# Altium project TAUV-Powerboard.PrjPCB
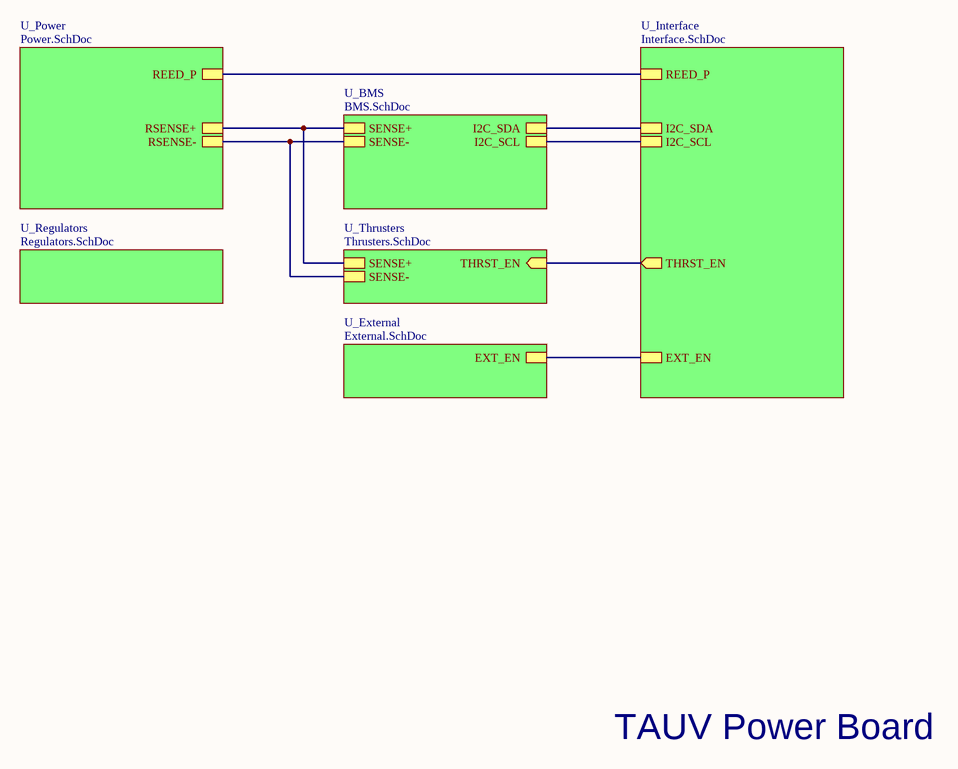
[diagram p0: Main.SchDoc]
7 sheets, 159 parts. Net scope: hierarchical (ports join the sheet entries above them; power ports are global).
Board file: TAUV-Powerboard.PcbDoc
Sheets:
  Main.SchDoc
    U_BMS = BMS.SchDoc
    U_Interface = Interface.SchDoc
    U_Power = Power.SchDoc
    U_Regulators = Regulators.SchDoc
    U_Thrusters = Thrusters.SchDoc
    U_External = External.SchDoc

## Sheet Main.SchDoc
size A

### Sub-sheets
U_BMS = BMS.SchDoc: SENSE-, I2C_SDA, I2C_SCL, SENSE+
U_External = External.SchDoc: EXT_EN
U_Interface = Interface.SchDoc: I2C_SDA, I2C_SCL, THRST_EN (out), REED_P, EXT_EN
U_Power = Power.SchDoc: RSENSE-, RSENSE+, REED_P
U_Regulators = Regulators.SchDoc: no entries
U_Thrusters = Thrusters.SchDoc: SENSE-, THRST_EN (in), SENSE+

### Nets
RSENSE-: sheet U_BMS/SENSE-, sheet U_Power/RSENSE-, sheet U_Thrusters/SENSE-
RSENSE+: sheet U_BMS/SENSE+, sheet U_Power/RSENSE+, sheet U_Thrusters/SENSE+
THRST_EN: sheet U_Interface/THRST_EN, sheet U_Thrusters/THRST_EN
NetP3_5: sheet U_Interface/REED_P, sheet U_Power/REED_P
NetP3_6: sheet U_BMS/I2C_SCL, sheet U_Interface/I2C_SCL
NetP3_11: sheet U_Interface/EXT_EN, sheet U_External/EXT_EN
NetP3_13: sheet U_BMS/I2C_SDA, sheet U_Interface/I2C_SDA

### Notes on the sheet
- TAUV Power Board

## Sheet BMS.SchDoc
size A4
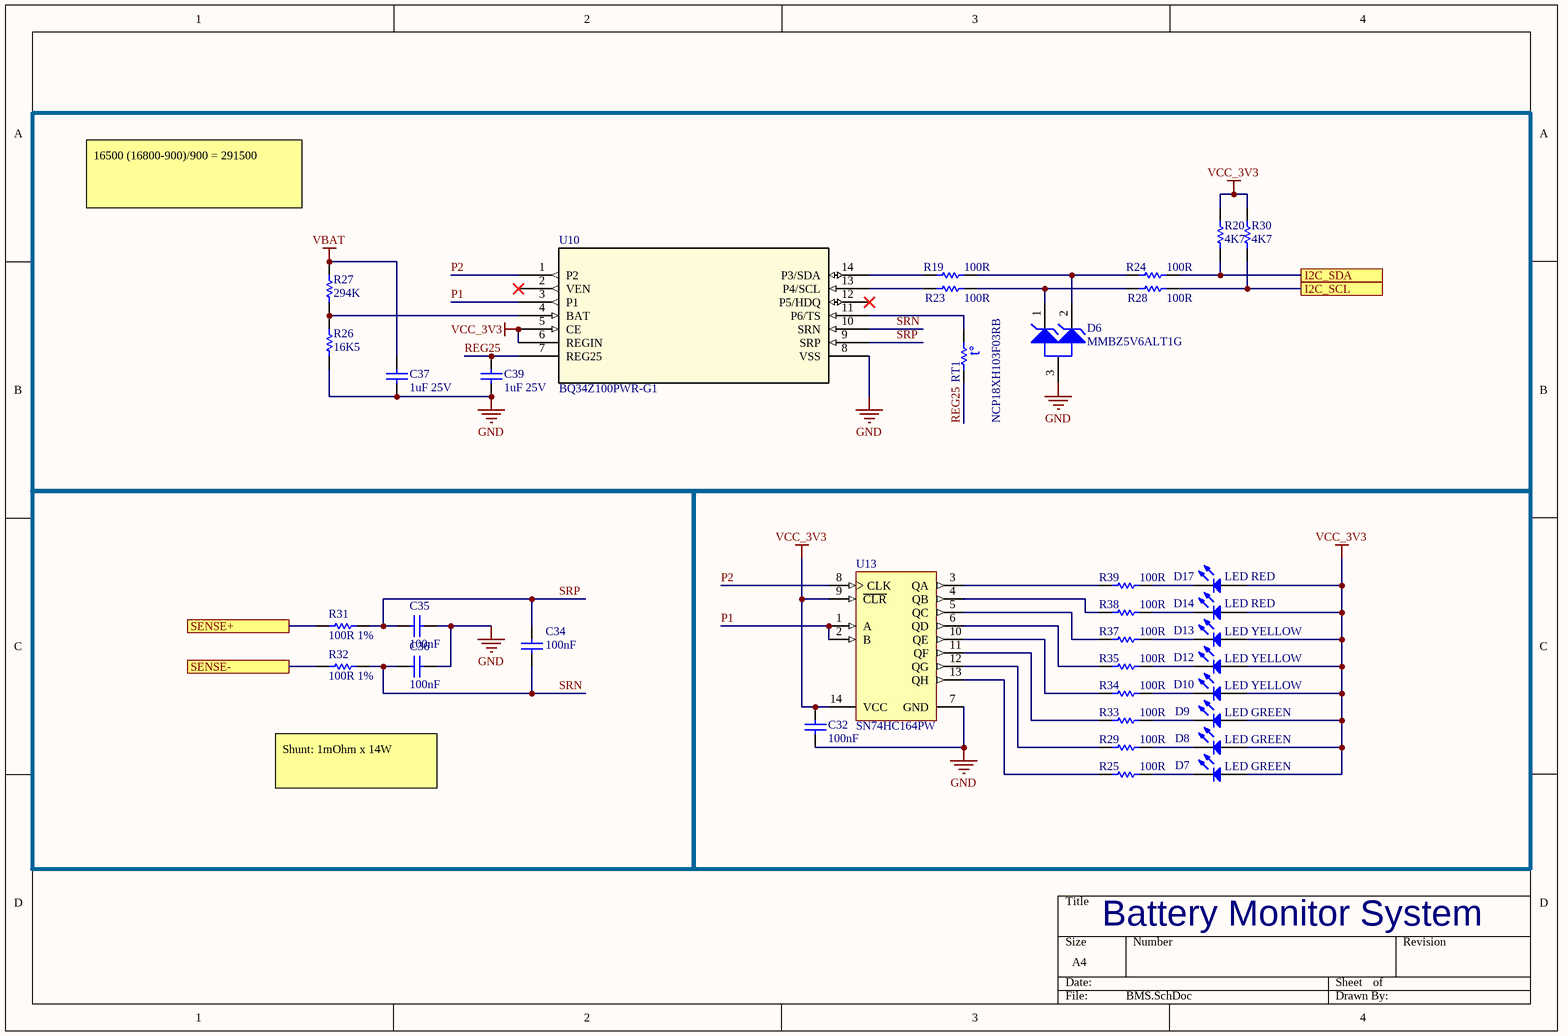
[diagram p1: BMS.SchDoc]

### Parts
C32  100nF  [CAPC0603(1608)100_L]
C34  100nF  [CAPC0603(1608)100_L]
C35  100nF  [CAPC0603(1608)100_L]
C36  100nF  [CAPC0603(1608)100_L]
C37  1uF 25V  [CAPC0603(1608)100_L]
C39  1uF 25V  [CAPC0603(1608)100_L]
D6  MMBZ5V6ALT1G  [ONSC-SOT-23-3-318-08_V]
D7  LED GREEN  [LED_0805]
D8  LED GREEN  [LED_0805]
D9  LED GREEN  [LED_0805]
D10  LED YELLOW  [LED_0805]
D12  LED YELLOW  [LED_0805]
D13  LED YELLOW  [LED_0805]
D14  LED RED  [LED_0805]
D17  LED RED  [LED_0805]
R19  100R  [RESC0603(1608)_L]
R20  4K7  [RESC0603(1608)_L]
R23  100R  [RESC0603(1608)_L]
R24  100R  [RESC0603(1608)_L]
R25  100R  [RESC0603(1608)_L]
R26  16K5  [RESC0603(1608)_L]
R27  294K  [RESC0603(1608)_L]
R28  100R  [RESC0603(1608)_L]
R29  100R  [RESC0603(1608)_L]
R30  4K7  [RESC0603(1608)_L]
R31  100R 1%  [RESC0603(1608)_L]
R32  100R 1%  [RESC0603(1608)_L]
R33  100R  [RESC0603(1608)_L]
R34  100R  [RESC0603(1608)_L]
R35  100R  [RESC0603(1608)_L]
R37  100R  [RESC0603(1608)_L]
R38  100R  [RESC0603(1608)_L]
R39  100R  [RESC0603(1608)_L]
RT1  NCP18XH103F03RB  [MURA-NCP18XH103F03RB-2_V]
U10  BQ34Z100PWR-G1  [PW14]
U13  SN74HC164PW  [PW0014A_N]

### Ports
I2C_SCL, I2C_SDA, SENSE+, SENSE-

### Nets
GND: C32.1 C35.1 C36.1 C37.1 C39.1 D6.3(A) R26.1 U10.8(VSS) U13.7(GND)
RSENSE-: R32.1 ; port SENSE-
VBAT: C37.2 R27.2
VCC_3V3: C32.2 D7.2(A) D8.2(A) D9.2(A) D10.2(A) D12.2(A) D13.2(A) D14.2(A) D17.2(A) R20.2 R30.2 U10.5(CE) U10.6(REGIN) U13.9(~{CLR}) U13.14(VCC)
P1: U10.3(P1) U13.1(A) U13.2(B)
P2: U10.1(P2) U13.8(CLK)
REG25: C39.2 RT1.1 U10.7(REG25)
RSENSE+: R31.1 ; port SENSE+
SRN: C34.1 C36.2 R32.2 U10.10(SRN)
SRP: C34.2 C35.2 R31.2 U10.9(SRP)
NetD6_1: D6.1(K1) R23.2 R28.1
NetD6_2: D6.2(K2) R19.2 R24.1
NetD7_1: D7.1(K) R25.2
NetD8_1: D8.1(K) R29.2
NetD9_1: D9.1(K) R33.2
NetD10_1: D10.1(K) R34.2
NetD12_1: D12.1(K) R35.2
NetD13_1: D13.1(K) R37.2
NetD14_1: D14.1(K) R38.2
NetD17_1: D17.1(K) R39.2
NetP3_6: R28.2 R30.1 ; port I2C_SCL
NetP3_13: R20.1 R24.2 ; port I2C_SDA
NetR19_1: R19.1 U10.14(P3/SDA)
NetR23_1: R23.1 U10.13(P4/SCL)
NetR25_1: R25.1 U13.13(QH)
NetR26_2: R26.2 R27.1 U10.4(BAT)
NetR29_1: R29.1 U13.12(QG)
NetR33_1: R33.1 U13.11(QF)
NetR34_1: R34.1 U13.10(QE)
NetR35_1: R35.1 U13.6(QD)
NetR37_1: R37.1 U13.5(QC)
NetR38_1: R38.1 U13.4(QB)
NetR39_1: R39.1 U13.3(QA)
NetRT1_2: RT1.2 U10.11(P6/TS)

Not connected (* = marked no-connect by the designer): U10 2(VEN)* 12(P5/HDQ)*

### Notes on the sheet
- 16500 (16800-900)/900 = 291500
- Shunt: 1mOhm x 14W
- Battery Monitor System
- (in symbol CMP-2000-05271-1) t°

### Library data of the parts
C32 C34-C36 = CMP-1035-02595-1: CAP 100nF 100V ±10% 0603 (1608 Metric) Thickness 1mm SMD; Tolerance: Â±10%; Case-EIA: 0603; Case-Metric: 1608; Rated Voltage: 100 V; Value: 100nF; Technology: SMT; Max Thickness: 1 mm
C37 C39 = CMP-1035-02740-1: CAP 1uF 25V ±10% 0603 (1608 Metric) Thickness 1mm SMD; Tolerance: Â±10%; Case-Metric: 1608; Case-EIA: 0603; Technology: SMT; Rated Voltage: 25 V; Max Thickness: 1 mm; Value: 1uF
D6 = CMP-1060-01222-1: 24 W Peak Power Zener Transient Voltage Suppressor, Dual Common Anode Zeners for ESD Protection, 3-Pin SOT-23, Pb-Free, Tape and Reel; Manufacturer: On Semiconductor; VZ Typ (V): 5.6; PackageVersion: Rev. AP, 11/2009; ComponentLink1URL: http://www.onsemi.com/; Packing: Tape and Reel; DatasheetVersion: Rev. 13; ComponentLink1Description: Manufacturer URL; ComponentLink3URL: http://www.onsemi.cn/pub_link/Collateral/318-08.PDF; ComponentLink2Description: Datasheet; PackageDescription: 3-Pin Small Outline Transistor, Body 2.92 x 1.3 mm, Pitch 0.95 mm; ComponentLink3Description: Package Specification; RoHS: Pb-Free; ComponentLink2URL: http://www.onsemi.cn/pub_link/Collateral/MMBZ5V6ALT1-D.PDF; PackageReference: SOT-23-3-318-08; Mounting Technology: Surface Mount; PartNumber: MMBZ5V6ALT1G
D7-D9 = LED0: led / LTST-C171KRKT; Manufacturer: Lite-On Inc.; Manufacturer Part Number: LTST-C171KGKT; Lens Color: Colorless; Lens Transparency: Clear; Millicandela Rating: 35mcd; Lens Style/Size: Rectangle with Flat Top, 1.40mm x 1.25mm; Voltage - Forward (Vf) (Typ): 2V; Current - Test: 20mA; Viewing Angle: 130°; Wavelength - Dominant: 571nm; Wavelength - Peak: 574nm; Supplier 1: Digi-Key; Supplier Part Number 1: 160-1426-1-ND; RoHS: RoHS Compliant; Category: Optoelectronics; Stock 1: 350441; Pricing 1: 1=0.31, 10=0.225, 25=0.1656, 100=0.1183, 250=0.0804, 500=0.07096, 1000=0.05558 (USD); Packaging: Cut Tape (CT); Part Status: Active; Color: Green; Mounting Type: Surface Mount; Features: -; Package / Case: 0805 (2012 Metric); Size / Dimension: 2.00mm L x 1.25mm W; Height (Max): 0.90mm; ComponentLink1URL: http://optoelectronics.liteon.com/upload/download/DS22-2000-118/LTST-C171KGKT.pdf; ComponentLink1Description: http://optoelectronics.liteon.com/upload/download/DS22-2000-118/LTST-C171KGKT.pdf
D10 D12 D13 = LED0: led / LTST-C171KSKT; Manufacturer: Lite-On Inc.; Color: Green; Lens Color: Colorless; Lens Transparency: Clear; Millicandela Rating: 35mcd; Lens Style/Size: Rectangle with Flat Top, 1.40mm x 1.25mm; Voltage - Forward (Vf) (Typ): 2V; Current - Test: 20mA; Viewing Angle: 130°; Wavelength - Dominant: 571nm; Wavelength - Peak: 574nm; Supplier 1: Digi-Key; Supplier Part Number 1: 160-1428-1-ND; Manufacturer Part Number: LTST-C171KSKT; RoHS: RoHS Compliant; Category: Optoelectronics; Stock 1: 350441; Pricing 1: 1=0.31, 10=0.225, 25=0.1656, 100=0.1183, 250=0.0804, 500=0.07096, 1000=0.05558 (USD); Packaging: Cut Tape (CT); Part Status: Active; Mounting Type: Surface Mount; Features: -; Package / Case: 0805 (2012 Metric); Size / Dimension: 2.00mm L x 1.25mm W; Height (Max): 0.90mm; ComponentLink1URL: http://optoelectronics.liteon.com/upload/download/DS22-2000-110/LTST-C171KSKT.pdf; ComponentLink1Description: http://optoelectronics.liteon.com/upload/download/DS22-2000-110/LTST-C171KSKT.pdf
D14 D17 = LED0: led / LTST-C171KRKT; Manufacturer: Lite-On Inc.; Lens Color: Colorless; Lens Transparency: Clear; Millicandela Rating: 54mcd; Lens Style/Size: Rectangle with Flat Top, 1.40mm x 1.25mm; Voltage - Forward (Vf) (Typ): 2V; Current - Test: 20mA; Viewing Angle: 130°; Wavelength - Dominant: 631nm; Wavelength - Peak: 639nm; Supplier 1: Digi-Key; Supplier Part Number 1: 160-1427-1-ND; Manufacturer Part Number: LTST-C171KRKT; RoHS: RoHS Compliant; Category: Optoelectronics; Stock 1: 260544; Pricing 1: 1=0.31, 10=0.225, 25=0.1656, 100=0.1183, 250=0.0804, 500=0.07096, 1000=0.05558 (USD); Packaging: Cut Tape (CT); Part Status: Active; Color: Red; Mounting Type: Surface Mount; Features: -; Package / Case: 0805 (2012 Metric); Size / Dimension: 2.00mm L x 1.25mm W; Height (Max): 0.80mm; ComponentLink1URL: http://optoelectronics.liteon.com/upload/download/DS22-2000-109/LTST-C171KRKT.pdf; ComponentLink1Description: http://optoelectronics.liteon.com/upload/download/DS22-2000-109/LTST-C171KRKT.pdf
R19 R23 R24 R28 R31 R32 = CMP-1012-00397-1: 100R 0.1W 1% 0603 (1608 Metric)  SMD; Value: 100.00 Ohm; Case-EIA: 0603; Case-Metric: 1608; Technology: SMT; Tolerance: 1 %; Power: 0.1 W
R20 R30 = CMP-1012-00586-1: 4K7 0.1W 1% 0603 (1608 Metric)  SMD; Case-EIA: 0603; Case-Metric: 1608; Value: 4700.00 Ohm; Power: 0.1 W; Tolerance: 1 %; Technology: SMT
R25 R29 R33-R35 R37-R39 = CMP-1012-00050-1: 100R 0.1W 5% 0603 (1608 Metric)  SMD; Case-EIA: 0603; Value: 100.00 Ohm; Case-Metric: 1608; Tolerance: 5 %; Technology: SMT; Power: 0.1 W
R26 = CMP-1012-00646-1: 16K5 0.1W 1% 0603 (1608 Metric)  SMD; Case-Metric: 1608; Value: 16500.00 Ohm; Case-EIA: 0603; Technology: SMT; Power: 0.1 W; Tolerance: 1 %
R27 = CMP-1012-00787-1: 294K 0.1W 1% 0603 (1608 Metric)  SMD; Case-Metric: 1608; Value: 294000.00 Ohm; Case-EIA: 0603; Power: 0.1 W; Tolerance: 1 %; Technology: SMT
RT1 = CMP-2000-05271-1: NTC Thermistor, 10 KOhm, +/- 1%, 0.1 W, -40 to 125 degC, 0603 (1608 Metric), RoHS, Tape and Reel; Manufacturer: Murata; B-constant: 3434K; Resistance: 10kO; Rated Current: 310A; Datasheet URL: http://www.jameco.com/Jameco/Products/ProdDS/1870999.pdf; Datasheet Version: Apr-05; Temperature Range: -40to+125degC; Tolerance (%): ±1%; Manufacturer URL: http://www.murata.com/; Type: NTC
U10 = BQ34Z100PWR-G1: No Description Available; Vendor: Texas Instruments; Built_By: EMA_UL_Team; Manufacturer_Part_Number: BQ34Z100PWR-G1; Copyright: Copyright (C) 2018 Accelerated Designs. All rights reserved; RefDes: RefDes; Type: DEV; Value: Value
U13 = CMP-0780-00173-3: 8-Bit Parallel-Out Serial Shift Registers, PW0014A, TUBE; Manufacturer: Texas Instruments; Output Drive (IOL/IOH)(Max)(mA): 5.2/-5.2; Technology Family: HC; 3-State Output: No; Voltage(Nom)(V): 6; ICC @ Nom Voltage(Max)(mA): 0.08; Rating: Catalog; F @ Nom Voltage(Max)(Mhz): 28; Output Type: CMOS; tpd @ Nom Voltage(Max)(ns): 38; VCC(Min)(V): 2; Bits: 4; DatasheetVersion: SCLS115F; VCC(Max)(V): 6; PackageReference: PW0014A; Input Type: CMOS; PackageVersion: http://www.ti.com/lit/ml/mpds360/mpds360.pdf; Operating Temperature Range(C): -40 to 125; Code_JEDEC: MO-153; Generic Part Number: SN74HC164

## Sheet Interface.SchDoc
size A
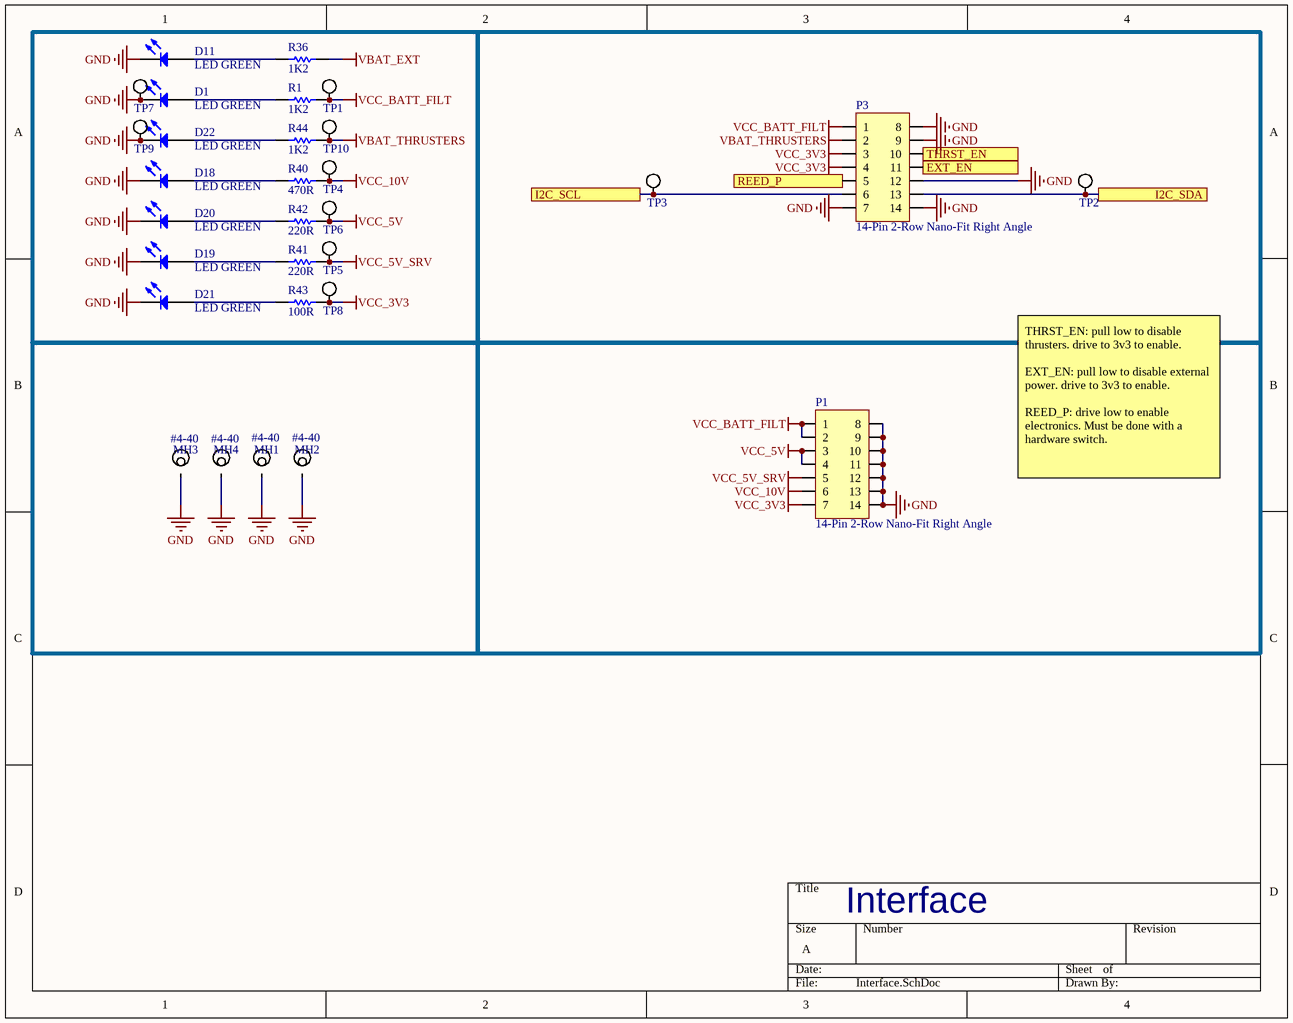
[diagram p2: Interface.SchDoc]

### Parts
D1  LED GREEN  [LED_0805]
D11  LED GREEN  [LED_0805]
D18  LED GREEN  [LED_0805]
D19  LED GREEN  [LED_0805]
D20  LED GREEN  [LED_0805]
D21  LED GREEN  [LED_0805]
D22  LED GREEN  [LED_0805]
MH1  #4-40  [Mounting Hole #4-40]
MH2  #4-40  [Mounting Hole #4-40]
MH3  #4-40  [Mounting Hole #4-40]
MH4  #4-40  [Mounting Hole #4-40]
P1  14-Pin 2-Row Nano-Fit Right Angle  [MOLEX NANO-FIT 2X7 - Right Angle]
P3  14-Pin 2-Row Nano-Fit Right Angle  [MOLEX NANO-FIT 2X7 - Right Angle]
R1  1K2  [RESC0603(1608)_L]
R36  1K2  [RESC0603(1608)_L]
R40  470R  [RESC0603(1608)_L]
R41  220R  [RESC0603(1608)_L]
R42  220R  [RESC0603(1608)_L]
R43  100R  [RESC0603(1608)_L]
R44  1K2  [RESC0603(1608)_L]
TP1  Test Point Loop  [Test Point Loop - Black]  (value not drawn)
TP2  Test Point Loop  [Test Point Loop - Black]  (value not drawn)
TP3  Test Point Loop  [Test Point Loop - Black]  (value not drawn)
TP4  Test Point Loop  [Test Point Loop - Black]  (value not drawn)
TP5  Test Point Loop  [Test Point Loop - Black]  (value not drawn)
TP6  Test Point Loop  [Test Point Loop - Black]  (value not drawn)
TP7  Test Point Loop  [Test Point Loop - Black]  (value not drawn)
TP8  Test Point Loop  [Test Point Loop - Black]  (value not drawn)
TP9  Test Point Loop  [Test Point Loop - Black]  (value not drawn)
TP10  Test Point Loop  [Test Point Loop - Black]  (value not drawn)

### Ports
EXT_EN (out), I2C_SCL, I2C_SDA, REED_P, THRST_EN (out)

### Nets
GND: D1.1(K) D11.1(K) D18.1(K) D19.1(K) D20.1(K) D21.1(K) D22.1(K) MH1.0 MH2.0 MH3.0 MH4.0 P1.8 P1.9 P1.10 P1.11 P1.12 P1.13 P1.14 P3.7 P3.8 P3.9 P3.12 P3.14 TP7.1 TP9.1
VBAT_EXT: R36.2
VBAT_THRUSTERS: P3.2 R44.2 TP10.1
VCC_3V3: P1.7 P3.3 P3.4 R43.2 TP8.1
VCC_5V: P1.3 P1.4 R42.2 TP6.1
VCC_5V_SRV: P1.5 R41.2 TP5.1
VCC_10V: P1.6 R40.2 TP4.1
VCC_BATT_FILT: P1.1 P1.2 P3.1 R1.2 TP1.1
THRST_EN: P3.10 ; port THRST_EN
NetD1_2: D1.2(A) R1.1
NetD11_2: D11.2(A) R36.1
NetD18_2: D18.2(A) R40.1
NetD19_2: D19.2(A) R41.1
NetD20_2: D20.2(A) R42.1
NetD21_2: D21.2(A) R43.1
NetD22_2: D22.2(A) R44.1
NetP3_5: P3.5 ; port REED_P
NetP3_6: P3.6 TP3.1 ; port I2C_SCL
NetP3_11: P3.11 ; port EXT_EN
NetP3_13: P3.13 TP2.1 ; port I2C_SDA

### Notes on the sheet
- THRST_EN: pull low to disable thrusters. drive to 3v3 to enable.
  EXT_EN: pull low to disable external power. drive to 3v3 to enable.
  REED_P: drive low to enable electronics. Must be done with a hardware switch.
- Interface

### Library data of the parts
D1 D11 D18-D22 = LED0: led; Manufacturer: Lite-On Inc.; Manufacturer Part Number: LTST-C171KGKT; Lens Color: Colorless; Lens Transparency: Clear; Millicandela Rating: 35mcd; Lens Style/Size: Rectangle with Flat Top, 1.40mm x 1.25mm; Voltage - Forward (Vf) (Typ): 2V; Current - Test: 20mA; Viewing Angle: 130°; Wavelength - Dominant: 571nm; Wavelength - Peak: 574nm; Supplier 1: Digi-Key; Supplier Part Number 1: 160-1426-1-ND; RoHS: RoHS Compliant; Category: Optoelectronics; Stock 1: 350441; Pricing 1: 1=0.31, 10=0.225, 25=0.1656, 100=0.1183, 250=0.0804, 500=0.07096, 1000=0.05558 (USD); Packaging: Cut Tape (CT); Part Status: Active; Color: Green; Mounting Type: Surface Mount; Features: -; Package / Case: 0805 (2012 Metric); Size / Dimension: 2.00mm L x 1.25mm W; Height (Max): 0.90mm; ComponentLink1URL: http://optoelectronics.liteon.com/upload/download/DS22-2000-118/LTST-C171KGKT.pdf; ComponentLink1Description: http://optoelectronics.liteon.com/upload/download/DS22-2000-118/LTST-C171KGKT.pdf
MH1-MH4 = Mounting Hole #4-40, Loose Fit: Mounting Hole for ANSI #4-40 w/ Flat Washer, Loose Fit; Datasheet: http://blogs.mentor.com/tom-hausherr/blog/tag/pcb-mounting-holes/
P1 P3 = 14-Pin 2-Row Nano-Fit Right Angle: NanoFit Right Hdr TH DR 14Ckt; Part Number: 105314-1214; Manufacturer: Molex; Supplier: Mouser; Supplier Part Number: 538-105314-1214; Supplier 1: Mouser; Supplier Part Number 1: 538-105314-1214; ComponentLink1Description: Mouser Link; ComponentLink1URL: https://www.mouser.com/ProductDetail/Molex/105314-1214?qs=PqFvFmEiOr6wLIXpvlvqbA%3D%3D
R1 R36 R44 = CMP-1012-00518-1: 1K2 0.1W 1% 0603 (1608 Metric)  SMD; Case-EIA: 0603; Value: 1200.00 Ohm; Case-Metric: 1608; Power: 0.1 W; Technology: SMT; Tolerance: 1 %
R40 = CMP-1012-00473-1: 470R 0.1W 1% 0603 (1608 Metric)  SMD; Value: 470.00 Ohm; Case-Metric: 1608; Case-EIA: 0603; Power: 0.1 W; Technology: SMT; Tolerance: 1 %
R41 R42 = CMP-1012-00058-1: 220R 0.1W 5% 0603 (1608 Metric)  SMD; Case-EIA: 0603; Case-Metric: 1608; Value: 220.00 Ohm; Technology: SMT; Power: 0.1 W; Tolerance: 5 %
R43 = CMP-1012-00050-1: as R25 on sheet BMS; Tolerance: 5 %; Technology: SMT; Power: 0.1 W
TP1-TP10 = Test Point Loop: Keyston Electronics 5001 Test Point Loop; Manufacturer P/N: 5001; Manufacturer: Keystone Electronics; Color: Black; Supplier 1: Digi-Key; Supplier Part Number 1: 36-5001-ND

## Sheet Power.SchDoc
size A
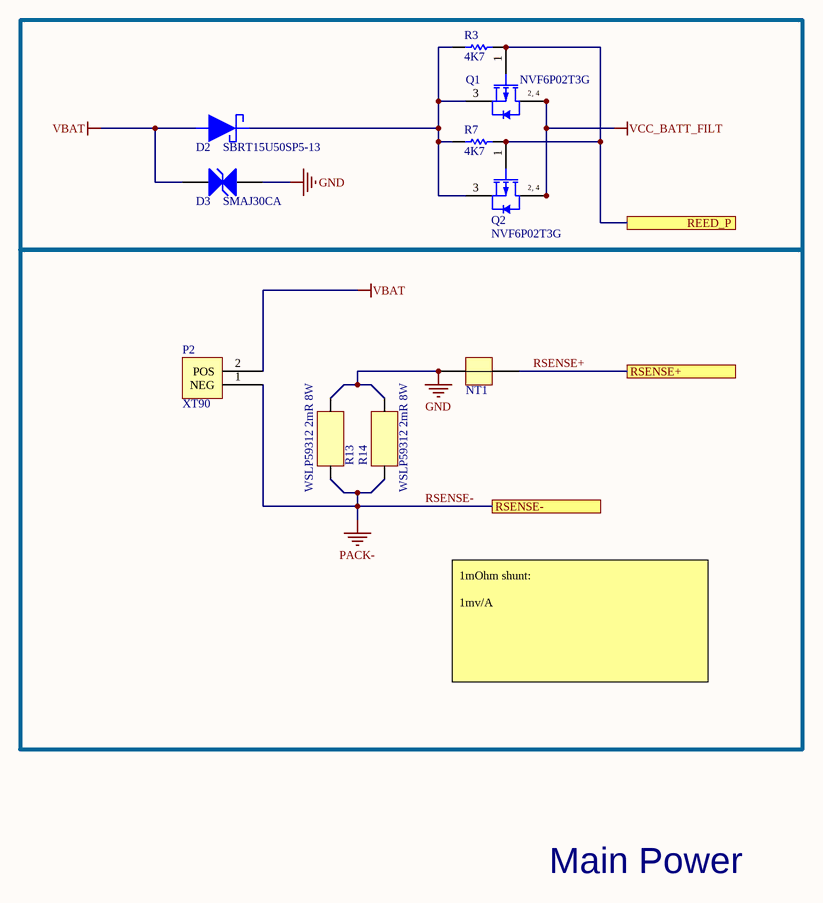
[diagram p3: Power.SchDoc]

### Parts
D2  SBRT15U50SP5-13  [SBRT15U50SP5-13]
D3  SMAJ30CA  [LFUS-DO-214AC-A-2_V]
NT1  Net Tie  [Net_Tie_80mil]  (value not drawn)  (net tie, no BOM)
P2  XT90  [XT90]
Q1  NVF6P02T3G  [ONSC-SOT-223-4-318E-04_V]
Q2  NVF6P02T3G  [ONSC-SOT-223-4-318E-04_V]
R3  4K7  [RESC0603(1608)_L]
R7  4K7  [RESC0603(1608)_L]
R13  WSLP59312 2mR 8W  [WSLP59312L000FEA]
R14  WSLP59312 2mR 8W  [WSLP59312L000FEA]

### Ports
REED_P, RSENSE+, RSENSE-

### Nets
GND: D3.2(A) NT1.1 R13.2 R14.2
RSENSE-: P2.1(NEG) R13.1 R14.1 ; port RSENSE-  [also labelled PACK-]
VBAT: D2.1 D3.1(A) P2.2(POS)
VCC_BATT_FILT: Q1.2(D) Q1.4(D) Q2.2(D) Q2.4(D)
RSENSE+: NT1.2 ; port RSENSE+
NetD2_2: D2.2 Q1.3(S) Q2.3(S) R3.2 R7.2
NetP3_5: Q1.1(G) Q2.1(G) R3.1 R7.1 ; port REED_P

### Notes on the sheet
- 1mOhm shunt:
  1mv/A
- Main Power
- (in symbol CMP-1058-00713-1) 2, 4

### Library data of the parts
D2 = SBRT15U50SP5-13: Manufacturer: Diodes Incorporated; Diode Type: Super Barrier; Current - Average Rectified (Io): 15A; Speed: Fast Recovery =< 500ns, > 200mA (Io); Supplier 1: Digi-Key; Supplier Part Number 1: SBRT15U50SP5-13DICT-ND; Manufacturer Part Number: SBRT15U50SP5-13; RoHS: RoHS Compliant; Category: Discrete Semiconductor Products; Stock 1: 12134; Pricing 1: 1=0.93, 10=0.823, 100=0.6306, 500=0.49852, 1000=0.39882 (USD); Packaging: Cut Tape (CT); Part Status: Active; Capacitance @ Vr, F: -; Mounting Type: Surface Mount; Package / Case: PowerDI™ 5; Supplier Device Package: PowerDI®5; Operating Temperature - Junction: -65°C ~ 150°C; ComponentLink1URL: https://media.digikey.com/pdf/Data%20Sheets/Diodes%20PDFs/SBRT15U50SP5.pdf; ComponentLink1Description: https://media.digikey.com/pdf/Data%20Sheets/Diodes%20PDFs/SBRT15U50SP5.pdf
D3 = CMP-2000-07088-1: Transient Voltage Suppression Diode, 30 V, -65 to 150 degC, 2-Pin SMD, RoHS, Tape and Reel; Manufacturer: Littelfuse-Inc.; Current - Peak Pulse (10/1000µs): 8.3A; Power - Peak Pulse: 400W; Voltage - Breakdown (Min): 33.3V; Bidirectional Channels: 1; Power Line Protection: No; Voltage - Clamping (Max) @ Ipp: 48.4V; Voltage - Reverse Standoff (Typ): 30V; Type: Zener; Category: CircuitProtection; Datasheet Version: 11/2015; Package Description: 2-Pin Surface Mount Device, Body 4.295 x 2.595 mm; Family: TVS-Diodes; Manufacturer URL: http://www.littelfuse.com/; Series: SMAJ; Package / Case: DO-214AC,SMA; Capacitance @ Frequency: -; Package Reference: DO-214AC; Packaging: Digi-Reel®; Applications: GeneralPurpose; Mounting Technology: SurfaceMount; Mounting Type: SurfaceMount; Unidirectional Channels: -; Supplier Device Package: DO-214AC(SMA); Operating Temperature: -55°C~150°C(TJ); Datasheet URL: http://www.littelfuse.com/~/media/electronics/datasheets/tvs_diodes/littelfuse_tvs_diode_smaj_datasheet.pdf.pdf
NT1 = Net Tie: Use to tie together nets
Q1 Q2 = CMP-1058-00713-1: Power MOSFET, -10 A, -20 V, P-Channel, 4-Pin SOT-223, Pb-Free, Tape and Reel; Manufacturer: On Semiconductor; VGS Max (V): 8; VGS(th) Max (V): 1; Channel Polarity: P Channel; V(BR)DSS Min (V): 20; Configuration: Single; Qrr Typ (nC): 36; PD Max (W): 8.3; Package Type: SOT-223-4 / TO-261-4; ComponentLink3URL: http://www.onsemi.com/pub_link/Collateral/318E-04.PDF; ComponentLink1Description: Manufacturer URL; ComponentLink2URL: http://www.onsemi.com/pub_link/Collateral/NTF6P02T3-D.PDF; Mounting Technology: Surface Mount; PackageVersion: Rev. N, 08/2009; RoHS: Pb-Free; Packing: Tape and Reel; PartNumber: NVF6P02T3G; PackageReference: SOT-223-4-318E-04; ComponentLink1URL: http://www.onsemi.com/; PackageDescription: 4-Pin Small Outline Transistor, Body 6.5 x 3.5 mm, Pitch 2.3 mm; ComponentLink3Description: Package Specification; ComponentLink2Description: Datasheet; DatasheetVersion: Rev. 6
R3 R7 = CMP-1012-00586-1: as R20 on sheet BMS; Power: 0.1 W; Tolerance: 1 %; Technology: SMT
R13 R14 = WSLP59312L000FEA

## Sheet Regulators.SchDoc
size A4
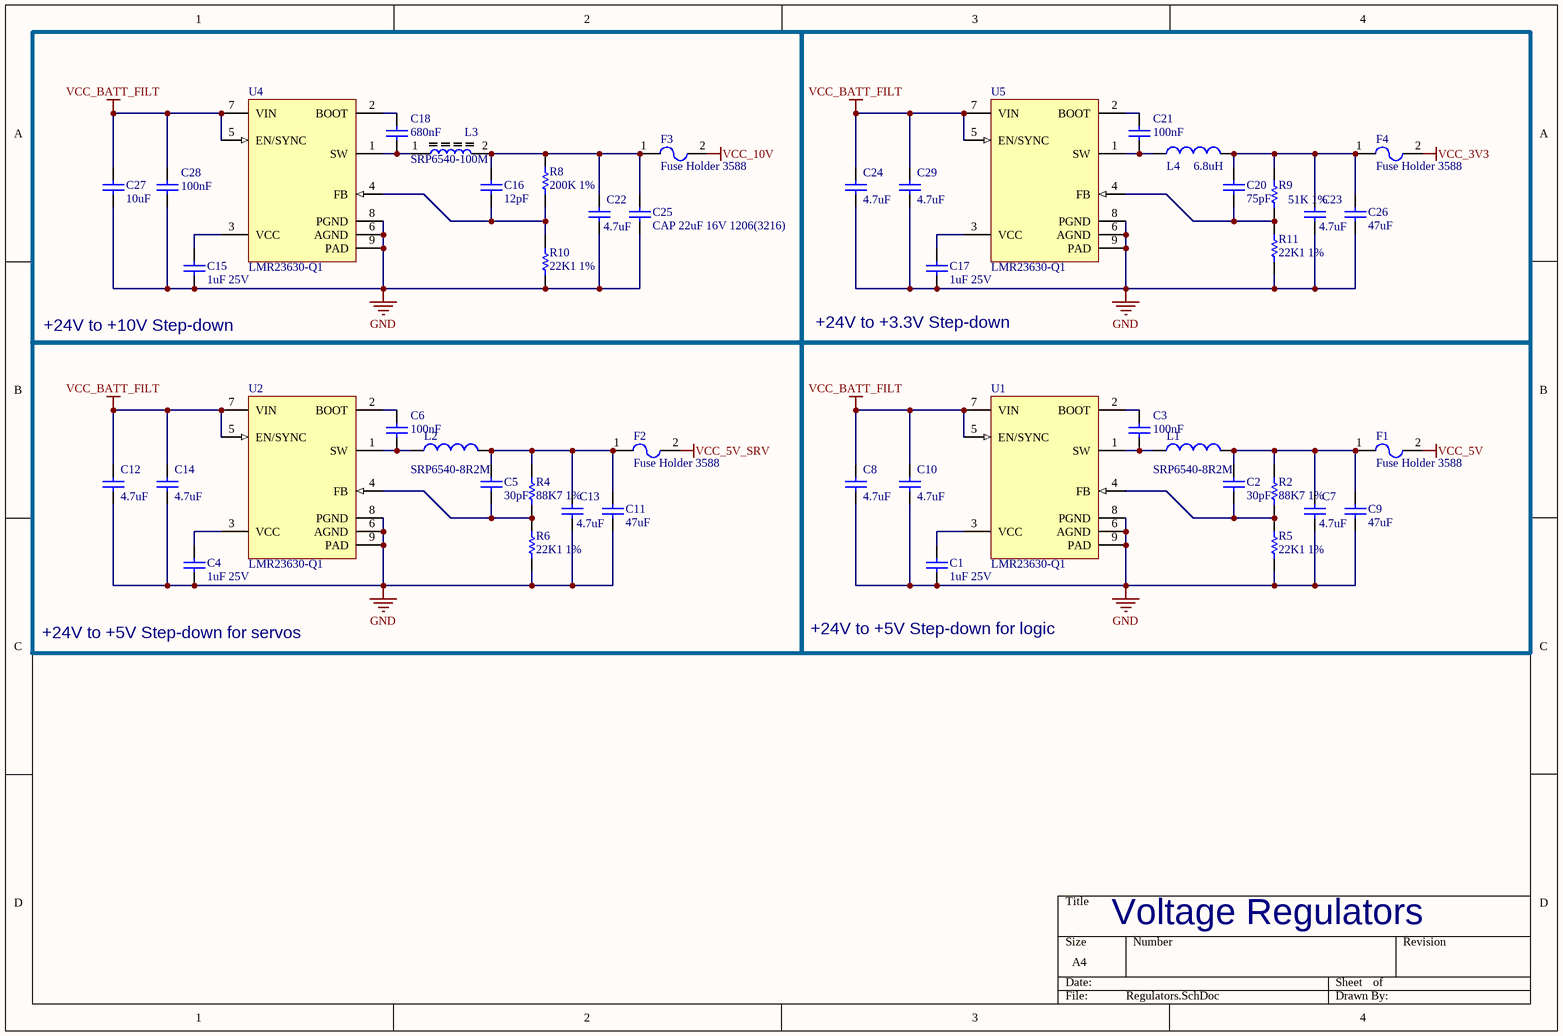
[diagram p4: Regulators.SchDoc]

### Parts
C1  1uF 25V  [CAPC0603(1608)100_L]
C2  30pF  [CAPC0603(1608)100_L]
C3  100nF  [CAPC0603(1608)100_L]
C4  1uF 25V  [CAPC0603(1608)100_L]
C5  30pF  [CAPC0603(1608)100_L]
C6  100nF  [CAPC0603(1608)100_L]
C7  4.7uF  [CAPC1206(3216)190_L]
C8  4.7uF  [CAPC1206(3216)190_L]
C9  47uF  [CAPC1206(3216)190_L]
C10  4.7uF  [CAPC1206(3216)190_L]
C11  47uF  [CAPC1206(3216)190_L]
C12  4.7uF  [CAPC1206(3216)190_L]
C13  4.7uF  [CAPC1206(3216)190_L]
C14  4.7uF  [CAPC1206(3216)190_L]
C15  1uF 25V  [CAPC0603(1608)100_L]
C16  12pF  [CAPC0603(1608)100_L]
C17  1uF 25V  [CAPC0603(1608)100_L]
C18  680nF  [CAPC0603(1608)100_L]
C20  75pF  [CAPC0603(1608)100_L]
C21  100nF  [CAPC0603(1608)100_L]
C22  4.7uF  [CAPC1206(3216)190_L]
C23  4.7uF  [CAPC1206(3216)190_L]
C24  4.7uF  [CAPC1206(3216)190_L]
C25  CAP 22uF 16V 1206(3216)  [CAPC1206(3216)190_L]
C26  47uF  [CAPC1206(3216)190_L]
C27  10uF  [CAPC1206(3216)190_L]
C28  100nF  [CAPC0603(1608)100_L]
C29  4.7uF  [CAPC1206(3216)190_L]
F1  Fuse Holder 3588  [Fuse Holder 3588]
F2  Fuse Holder 3588  [Fuse Holder 3588]
F3  Fuse Holder 3588  [Fuse Holder 3588]
F4  Fuse Holder 3588  [Fuse Holder 3588]
L1  SRP6540-8R2M  [BOURNS SRP5030T]
L2  SRP6540-8R2M  [BOURNS SRP5030T]
L3  SRP6540-100M  [IND_SRP6540-100M]
L4  6.8uH  [BOURNS SRP5030T]
R2  88K7 1%  [RESC0603(1608)_L]
R4  88K7 1%  [RESC0603(1608)_L]
R5  22K1 1%  [RESC0603(1608)_L]
R6  22K1 1%  [RESC0603(1608)_L]
R8  200K 1%  [RESC0603(1608)_L]
R9  51K 1%  [RESC0603(1608)_L]
R10  22K1 1%  [RESC0603(1608)_L]
R11  22K1 1%  [RESC0603(1608)_L]
U1  LMR23630-Q1  [DDA0008E_N]
U2  LMR23630-Q1  [DDA0008E_N]
U4  LMR23630-Q1  [DDA0008E_N]
U5  LMR23630-Q1  [DDA0008E_N]

### Blocks framed on the sheet
+24V to +10V Step-down: C15 C16 C18 C22 C25 C27 C28 F3 L3 R8 R10 U4
+24V to +3.3V Step-down: C17 C20 C21 C23 C24 C26 C29 F4 L4 R9 R11 U5
+24V to +5V Step-down for servos: C4-C6 C11-C14 F2 L2 R4 R6 U2
+24V to +5V Step-down for logic: C1-C3 C7-C10 F1 L1 R2 R5 U1

### Nets
GND: C1.1 C4.1 C7.1 C8.1 C9.1 C10.1 C11.1 C12.1 C13.1 C14.1 C15.1 C17.1 C22.1 C23.1 C24.1 C25.1 C26.1 C27.1 C28.1 C29.1 R5.1 R6.1 R10.1 R11.1 U1.6(AGND) U1.8(PGND) U1.9(PAD) U2.6(AGND) U2.8(PGND) U2.9(PAD) U4.6(AGND) U4.8(PGND) U4.9(PAD) U5.6(AGND) U5.8(PGND) U5.9(PAD)
VCC_3V3: F4.2
VCC_5V: F1.2
VCC_5V_SRV: F2.2
VCC_10V: F3.2
VCC_BATT_FILT: C8.2 C10.2 C12.2 C14.2 C24.2 C27.2 C28.2 C29.2 U1.5(EN/SYNC) U1.7(VIN) U2.5(EN/SYNC) U2.7(VIN) U4.5(EN/SYNC) U4.7(VIN) U5.5(EN/SYNC) U5.7(VIN)
NetC1_2: C1.2 U1.3(VCC)
NetC2_1: C2.1 R2.1 R5.2 U1.4(FB)
NetC2_2: C2.2 C7.2 C9.2 F1.1 L1.2 R2.2
NetC3_1: C3.1 L1.1 U1.1(SW)
NetC3_2: C3.2 U1.2(BOOT)
NetC4_2: C4.2 U2.3(VCC)
NetC5_1: C5.1 R4.1 R6.2 U2.4(FB)
NetC5_2: C5.2 C11.2 C13.2 F2.1 L2.2 R4.2
NetC6_1: C6.1 L2.1 U2.1(SW)
NetC6_2: C6.2 U2.2(BOOT)
NetC15_2: C15.2 U4.3(VCC)
NetC16_1: C16.1 R8.1 R10.2 U4.4(FB)
NetC16_2: C16.2 C22.2 C25.2 F3.1 L3.2 R8.2
NetC17_2: C17.2 U5.3(VCC)
NetC18_1: C18.1 L3.1 U4.1(SW)
NetC18_2: C18.2 U4.2(BOOT)
NetC20_1: C20.1 R9.1 R11.2 U5.4(FB)
NetC20_2: C20.2 C23.2 C26.2 F4.1 L4.2 R9.2
NetC21_1: C21.1 L4.1 U5.1(SW)
NetC21_2: C21.2 U5.2(BOOT)

### Notes on the sheet
- Voltage Regulators

### Library data of the parts
C1 C4 C15 C17 = CMP-1035-02740-1: as C37 on sheet BMS; Technology: SMT; Rated Voltage: 25 V; Max Thickness: 1 mm; Value: 1uF
C2 C5 = CMP-1035-00915-1: CAP 30pF 50V ±10% 0603 (1608 Metric) Thickness 1mm SMD; Tolerance: Â±10%; Case-Metric: 1608; Case-EIA: 0603; Rated Voltage: 50 V; Technology: SMT; Value: 30pF; Max Thickness: 1 mm
C3 C6 C21 C28 = CMP-1035-02595-1: as C32 on sheet BMS; Rated Voltage: 100 V; Value: 100nF; Technology: SMT; Max Thickness: 1 mm
C7 C8 C10 C12-C14 C22-C24 C29 = CMP-1037-04922-1: CAP 4.7uF 35V ±10% 1206 (3216 Metric) Thickness 1.9mm SMD; Case-EIA: 1206; Tolerance: Â±10%; Case-Metric: 3216; Rated Voltage: 35 V; Technology: SMT; Value: 4.7uF; Max Thickness: 1.9 mm
  C7 C13 C22 C23: Supplier 1: Digi-Key
C9 C11 C26 = CMP-1037-05003-1: CAP 47uF 16V ±20% 1206 (3216 Metric) Thickness 1.9mm SMD; Case-EIA: 1206; Tolerance: Â±20%; Case-Metric: 3216; Rated Voltage: 16 V; Technology: SMT; Value: 47uF; Max Thickness: 1.9 mm
C16 = CMP-1035-00615-1: CAP 12pF 50V ±0.25pF 0603 (1608 Metric) Thickness 1mm SMD; Tolerance: Â±0.25pF; Case-EIA: 0603; Case-Metric: 1608; Max Thickness: 1 mm; Rated Voltage: 50 V; Value: 12pF; Technology: SMT
C18 = CMP-1035-02724-1: CAP 680nF 50V ±10% 0603 (1608 Metric) Thickness 1mm SMD; Tolerance: Â±10%; Case-EIA: 0603; Case-Metric: 1608; Technology: SMT; Value: 680nF; Max Thickness: 1 mm; Rated Voltage: 50 V
C20 = CMP-1035-01189-1: CAP 75pF 25V ±1% 0603 (1608 Metric) Thickness 1mm SMD; Case-Metric: 1608; Case-EIA: 0603; Tolerance: Â±1%; Rated Voltage: 25 V; Technology: SMT; Max Thickness: 1 mm; Value: 75pF
C25 = CMP-1037-04993-1: CAP 22uF 16V ±20% 1206 (3216 Metric) Thickness 1.9mm SMD; Tolerance: Â±20%; Case-Metric: 3216; Case-EIA: 1206; Value: 22uF; Rated Voltage: 16 V; Technology: SMT; Max Thickness: 1.9 mm
C27 = CMP-1037-04982-1: CAP 10uF 50V ±10% 1206 (3216 Metric) Thickness 1.9mm SMD; Case-EIA: 1206; Tolerance: Â±10%; Case-Metric: 3216; Technology: SMT; Max Thickness: 1.9 mm; Value: 10uF; Rated Voltage: 50 V
F1-F4 = 3588 Fuse Holder: Keystone Electronics 3588; Supplier 1: Digi-Key; Supplier Part Number 1: 36-3588-ND; Datasheet: http://keyelco.com/userAssets/file/M65p43.pdf
L1 L2 = SRP5030TA_8R2: ComponentLink1URL: http://www.bourns.com/docs/Product-Datasheets/SRP5030TA.pdf; ComponentLink1Description: http://www.bourns.com/docs/Product-Datasheets/SRP5030TA.pdf; Supplier 1: Digi-Key; Supplier Part Number 1: SRP6540-8R2MCT-ND
L3 = SRP6540-100M: Inductor Power Shielded/Molded Wirewound 10uH 20% 100KHz Powdered Iron 4A 78.5mOhm DCR T/R; MF: Bourns; Digi-Key_Part_Number: SRP6540-100MCT-ND; SnapEDA_Link: https://www.snapeda.com/parts/SRP6540-100M/Bourns/view-part/?ref=snap; Package: Nonstandard Bourns; MP: SRP6540-100M; Digi-Key_Purchase_URL: https://www.digikey.com/product-detail/en/bourns-inc/SRP6540-100M/SRP6540-100MCT-ND/3986041?utm_source=snapeda&utm_medium=aggregator&utm_campaign=symbol; Value: *
L4 = SRP5030TA: Manufacturer: Bourns Inc.; Manufacturer Part Number: SRP5030TA-6R8M; Type: Wirewound; Material - Core: Carbonyl Powder; Tolerance: ±20%; Shielding: Shielded; DC Resistance (DCR): 76.2 mOhm Max; Q @ Freq: 15 @ 100kHz; Supplier 1: Digi-Key; RoHS: RoHS Compliant; Category: Inductors, Coils, Chokes; Stock 1: 5626; Pricing 1: 1=1.51, 10=1.397, 100=0.9781, 500=0.79178, 1000=0.72191 (USD); Packaging: Cut Tape (CT); Part Status: Active; Ratings: AEC-Q200; Operating Temperature: -40°C ~ 150°C; Mounting Type: Surface Mount; Package / Case: Nonstandard; Supplier Device Package: -; Size / Dimension: 0.224" L x 0.205" W (5.70mm x 5.20mm); Height - Seated (Max): 0.118" (3.00mm); ComponentLink1URL: http://www.bourns.com/docs/Product-Datasheets/SRP5030TA.pdf; ComponentLink1Description: http://www.bourns.com/docs/Product-Datasheets/SRP5030TA.pdf; Supplier Part Number 1: SRP5030TA-6R8MCT-ND
R2 R4 = CMP-1012-00730-1: 88K7 0.1W 1% 0603 (1608 Metric)  SMD; Value: 88700.00 Ohm; Case-Metric: 1608; Case-EIA: 0603; Tolerance: 1 %; Power: 0.1 W; Technology: SMT
R5 R6 R10 R11 = CMP-1012-00660-1: 22K1 0.1W 1% 0603 (1608 Metric)  SMD; Case-EIA: 0603; Case-Metric: 1608; Value: 22100.00 Ohm; Tolerance: 1 %; Power: 0.1 W; Technology: SMT
R8 = CMP-1012-00768-1: 200K 0.1W 1% 0603 (1608 Metric)  SMD; Case-Metric: 1608; Value: 200000.00 Ohm; Case-EIA: 0603; Power: 0.1 W; Technology: SMT; Tolerance: 1 %
R9 = CMP-1012-00703-1: 51K 0.1W 1% 0603 (1608 Metric)  SMD; Case-EIA: 0603; Case-Metric: 1608; Value: 51000.00 Ohm; Tolerance: 1 %; Technology: SMT; Power: 0.1 W
U1 U2 U4 U5 = LMR23630-Q1: Manufacturer: Texas Instruments; Manufacturer Part Number: LMR23630AFQDDARQ1; Function: Step-Down; Output Configuration: Positive; Topology: Buck; Output Type: Adjustable; Number of Outputs: 1; Voltage - Input (Min): 4.5V; Voltage - Input (Max): 36V; Voltage - Output (Min/Fixed): 1V; Voltage - Output (Max): 28V; Current - Output: 3A; Frequency - Switching: 400kHz; Synchronous Rectifier: Yes; Supplier 1: Digi-Key; RoHS: RoHS Compliant; Category: Integrated Circuits (ICs); Stock 1: 1636; Pricing 1: 1=3.97, 10=3.564, 100=2.9204, 500=2.48604, 1000=2.09667 (USD); Packaging: Digi-Reel®; Part Status: Active; Operating Temperature: -40°C ~ 125°C (TJ); Mounting Type: Surface Mount; Package / Case: 8-SOIC (0.154", 3.90mm Width) Exposed Pad; Supplier Device Package: 8-SO PowerPad; ComponentLink1URL: http://www.ti.com/lit/ds/symlink/lmr23630-q1.pdf; ComponentLink1Description: http://www.ti.com/lit/ds/symlink/lmr23630-q1.pdf; Supplier Part Number 1: 296-45260-6-ND

## Sheet Thrusters.SchDoc
size A
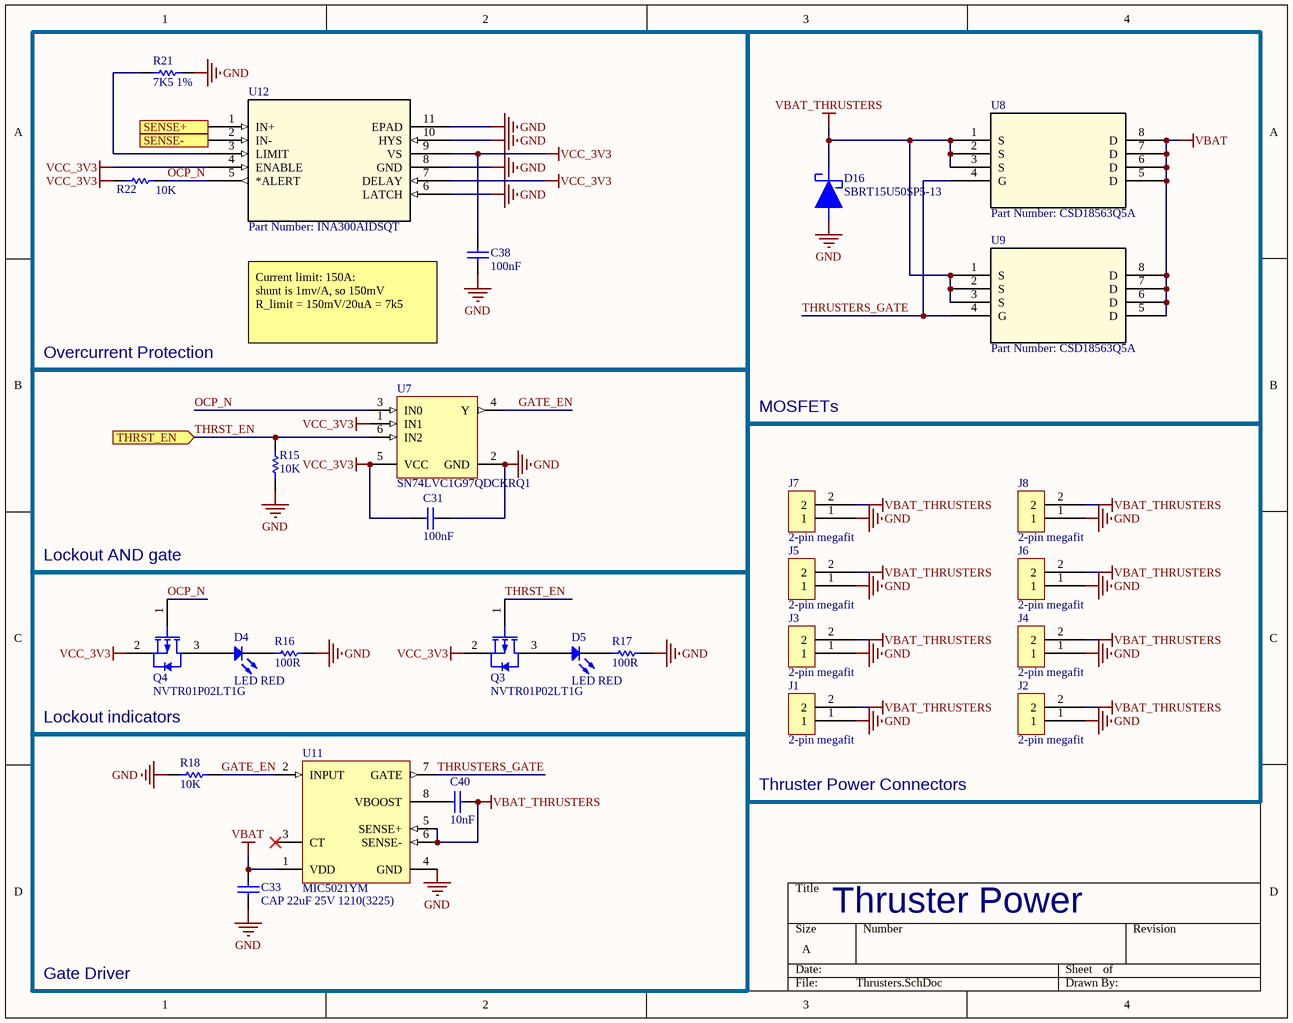
[diagram p5: Thrusters.SchDoc]

### Parts
C31  100nF  [CAPC0603(1608)100_N]
C33  CAP 22uF 25V 1210(3225)  [CAPC1210(3225)220_L]
C38  100nF  [CAPC0603(1608)100_N]
C40  10nF  [CAPC0603(1608)100_L]
D4  LED RED  [LED_0805]
D5  LED RED  [LED_0805]
D16  SBRT15U50SP5-13  [SBRT15U50SP5-13]
J1  2-pin megafit  [2-pin Megafit RA]
J2  2-pin megafit  [2-pin Megafit RA]
J3  2-pin megafit  [2-pin Megafit RA]
J4  2-pin megafit  [2-pin Megafit RA]
J5  2-pin megafit  [2-pin Megafit RA]
J6  2-pin megafit  [2-pin Megafit RA]
J7  2-pin megafit  [2-pin Megafit RA]
J8  2-pin megafit  [2-pin Megafit RA]
Q3  NVTR01P02LT1G  [ONSC-SOT-23-3-318-08_V]
Q4  NVTR01P02LT1G  [ONSC-SOT-23-3-318-08_V]
R15  10K  [RESC0603(1608)_N]
R16  100R  [RESC0603(1608)_N]
R17  100R  [RESC0603(1608)_N]
R18  10K  [RESC0603(1608)_N]
R21  7K5 1%  [RESC0603(1608)_N]
R22  10K  [RESC0603(1608)_N]
U7  SN74LVC1G97QDCKRQ1  [DCK0006A_L]
U8  Part Number: CSD18563Q5A  [DQJ8]
U9  Part Number: CSD18563Q5A  [DQJ8]
U11  MIC5021YM  [MICL-SOICN-8LD-PL-1_V]
U12  Part Number: INA300AIDSQT  [DSQ10_P9X1P5]

### Blocks framed on the sheet
Overcurrent Protection: C38 R21 R22 U12
MOSFETs: D16 U8 U9

### Ports
SENSE+, SENSE-, THRST_EN (in)

### Nets
GND: C31.1 C33.1 C38.1 D16.1 J1.1 J2.1 J3.1 J4.1 J5.1 J6.1 J7.1 J8.1 R15.2 R16.2 R17.2 R18.2 R21.2 U7.2(GND) U11.4(GND) U12.6(LATCH) U12.8(GND) U12.10(HYS) U12.11(EPAD)
RSENSE-: U12.2(IN-) ; port SENSE-
VBAT: C33.2 U8.5(D) U8.6(D) U8.7(D) U8.8(D) U9.5(D) U9.6(D) U9.7(D) U9.8(D) U11.1(VDD)
VBAT_THRUSTERS: C40.2 D16.2 J1.2 J2.2 J3.2 J4.2 J5.2 J6.2 J7.2 J8.2 U8.1(S) U8.2(S) U8.3(S) U9.1(S) U9.2(S) U9.3(S) U11.5(SENSE+) U11.6(SENSE-)
VCC_3V3: C31.2 C38.2 Q3.2(S) Q4.2(S) R22.2 U7.1(IN1) U7.5(VCC) U12.4(ENABLE) U12.7(DELAY) U12.9(VS)
GATE_EN: R18.1 U7.4(Y) U11.2(INPUT)
OCP_N: Q4.1(G) R22.1 U7.3(IN0) U12.5(*ALERT)
RSENSE+: U12.1(IN+) ; port SENSE+
THRST_EN: Q3.1(G) R15.1 U7.6(IN2) ; port THRST_EN
THRUSTERS_GATE: U8.4(G) U9.4(G) U11.7(GATE)
NetC40_1: C40.1 U11.8(VBOOST)
NetD4_1: D4.1(K) R16.1
NetD4_2: D4.2(A) Q4.3(D)
NetD5_1: D5.1(K) R17.1
NetD5_2: D5.2(A) Q3.3(D)
NetR21_1: R21.1 U12.3(LIMIT)

Not connected (* = marked no-connect by the designer): U11 3(CT)*

### Notes on the sheet
- (near C38) Current limit: 150A:
  shunt is 1mv/A, so 150mV
  R_limit = 150mV/20uA = 7k5
- Lockout AND gate
- Lockout indicators
- Thruster Power Connectors
- Thruster Power
- Gate Driver

### Library data of the parts
C31 C38 = CMP-1035-02580-1: CAP 100nF 10V ±10% 0603 (1608 Metric) Thickness 1mm SMD; Tolerance: Â±10%; Case-EIA: 0603; Case-Metric: 1608; Max Thickness: 1 mm; Value: 100nF; Rated Voltage: 10 V; Technology: SMT
C33 = CMP-1038-02286-1: CAP 22uF 25V -20% to +80% 1210 (3225 Metric) Thickness 2.2mm SMD; Case-Metric: 3225; Case-EIA: 1210; Rated Voltage: 25 V; Technology: SMT; Max Thickness: 2.2 mm; Value: 22uF; Tolerance: -20% to +80%
C40 = CMP-1035-02315-1: CAP 10nF 25V ±2% 0603 (1608 Metric) Thickness 1mm SMD; Tolerance: Â±2%; Case-Metric: 1608; Case-EIA: 0603; Rated Voltage: 25 V; Technology: SMT; Max Thickness: 1 mm; Value: 10nF
D4 D5 = LED0: as D14 on sheet BMS; Supplier 1: Digi-Key; Supplier Part Number 1: 160-1427-1-ND; Manufacturer Part Number: LTST-C171KRKT; RoHS: RoHS Compliant; Category: Optoelectronics; Stock 1: 260544; Pricing 1: 1=0.31, 10=0.225, 25=0.1656, 100=0.1183, 250=0.0804, 500=0.07096, 1000=0.05558 (USD); Packaging: Cut Tape (CT); Part Status: Active; Color: Red; Mounting Type: Surface Mount; Features: -; Package / Case: 0805 (2012 Metric); Size / Dimension: 2.00mm L x 1.25mm W; Height (Max): 0.80mm; ComponentLink1URL: http://optoelectronics.liteon.com/upload/download/DS22-2000-109/LTST-C171KRKT.pdf; ComponentLink1Description: http://optoelectronics.liteon.com/upload/download/DS22-2000-109/LTST-C171KRKT.pdf
D16 = SBRT15U50SP5-13: as D2 on sheet Power; Supplier 1: Digi-Key; Supplier Part Number 1: SBRT15U50SP5-13DICT-ND; Manufacturer Part Number: SBRT15U50SP5-13; RoHS: RoHS Compliant; Category: Discrete Semiconductor Products; Stock 1: 12134; Pricing 1: 1=0.93, 10=0.823, 100=0.6306, 500=0.49852, 1000=0.39882 (USD); Packaging: Cut Tape (CT); Part Status: Active; Capacitance @ Vr, F: -; Mounting Type: Surface Mount; Package / Case: PowerDI™ 5; Supplier Device Package: PowerDI®5; Operating Temperature - Junction: -65°C ~ 150°C; ComponentLink1URL: https://media.digikey.com/pdf/Data%20Sheets/Diodes%20PDFs/SBRT15U50SP5.pdf; ComponentLink1Description: https://media.digikey.com/pdf/Data%20Sheets/Diodes%20PDFs/SBRT15U50SP5.pdf
Q3 Q4 = CMP-1058-00752-1: Power MOSFET, -20 V, -1.3 A, P-Channel, 3-Pin SOT-23, Pb-Free, Tape and Reel; Manufacturer: On Semiconductor; Ciss Typ (pF): 225; Configuration: Single; Coss Typ (pF): 130; PD Max (W): 0.4; ID Max (A): 1.3; Crss Typ (pF): 55; VGS Max (V): 12; V(BR)DSS Min (V): 20; VGS(th) Max (V): 1.25; Qrr Typ (nC): 8.5; Channel Polarity: P Channel; ComponentLink1URL: http://www.onsemi.com/; PackageReference: SOT-23-3-318-08; RoHS: Pb-Free; ComponentLink1Description: Manufacturer URL; PackageDescription: 3-Pin Small Outline Transistor, Body 2.92 x 1.3 mm, Pitch 0.95 mm; ComponentLink3Description: Package Specification; ComponentLink2Description: Datasheet; Package Type: SOT-23-3; ComponentLink2URL: http://www.onsemi.cn/pub_link/Collateral/NTR1P02LT1-D.PDF; Packing: Tape and Reel; Mounting Technology: Surface Mount; ComponentLink3URL: http://www.onsemi.cn/pub_link/Collateral/318-08.PDF; PartNumber: NVTR01P02LT1G; PackageVersion: Rev. AP, 11/2009; DatasheetVersion: Rev. 13
R15 R18 R22 = CMP-1012-00098-1: 10K 0.1W 5% 0603 (1608 Metric)  SMD; Case-EIA: 0603; Value: 10000.00 Ohm; Case-Metric: 1608; Technology: SMT; Tolerance: 5 %; Power: 0.1 W
R16 R17 = CMP-1012-00050-1: as R25 on sheet BMS; Tolerance: 5 %; Technology: SMT; Power: 0.1 W
R21 = CMP-1012-00609-1: 7K5 0.1W 1% 0603 (1608 Metric)  SMD; Case-Metric: 1608; Value: 7500.00 Ohm; Case-EIA: 0603; Technology: SMT; Tolerance: 1 %; Power: 0.1 W
U7 = CMP-0859-00512-3: Automotive Catalog Configurable Multiple-Function Gate, DCK0006A, LARGE T&R; Manufacturer: Texas Instruments; Generic Part Number: SN74LVC1G97-Q1; Input Type: CMOS/TTL; tpd @ Nom Voltage(Max)(ns): 16.4,9.3,7.3,6.1; VCC(Max)(V): 5.5; VCC(Min)(V): 1.65; Schmitt Trigger: No; Voltage(Nom)(V): 1.8,2.5,3.3,5; F @ Nom Voltage(Max)(Mhz): 150; Output Drive (IOL/IOH)(Max)(mA): 32/-32; Technology Family: LVC; Logic: True; Output Type: CMOS; ICC @ Nom Voltage(Max)(mA): 0.01; Sub-Family: Configurable Logic; Bits(#): 1; Operating Temperature Range(C): -40 to 125; DatasheetVersion: SCES561D; Gate Type: Configurable; 3-State Output: No; PackageReference: DCK0006A; Rating: Automotive
U8 U9 = CSD18563Q5A: No Description Available; Vendor: Texas Instruments; Built_By: EMA_UL_Team; Manufacturer_Part_Number: CSD18563Q5A; Copyright: Copyright (C) 2018 Accelerated Designs. All rights reserved; RefDes: RefDes; Type: DEV; Value: Value
U11 = CMP-1558-00003-1: High-Speed High-Side MOSFET Driver, 12 to 36 V, -40 to 85 degC, 8-Pin SOIC, RoHS, Tube; VDD Min: 12 V; VDD Max: 36 V; ComponentLink2Description: Datasheet; Temperature Max: 85 degC; PackageDescription: 8-Pin Small Outline Integrated Package, Body 4.89 x 3.90 mm, Pitch 1.27 mm; ComponentLink1Description: Manufacturer URL; RoHS: TRUE; Temperature Min: -40 degC; ComponentLink2URL: http://www.micrel.com/_PDF/mic5021.pdf; PackageVersion: Rev. A; ComponentLink3Description: Package Specification; PartNumber: MIC5021YM; ComponentLink3URL: http://www.micrel.com/_Packages/SOICN-8LD-PL-1.pdf; Packing: Tube; Mounting Technology: Surface Mount; ComponentLink1URL: http://www.micrel.com/
U12 = INA300AIDSQT: No Description Available; Vendor: Texas Instruments; Built_By: EMA_UL_Team; Manufacturer_Part_Number: INA300AIDSQT; Copyright: Copyright (C) 2018 Accelerated Designs. All rights reserved; RefDes: RefDes; Type: DEV; Value: Value

## Sheet External.SchDoc
size A
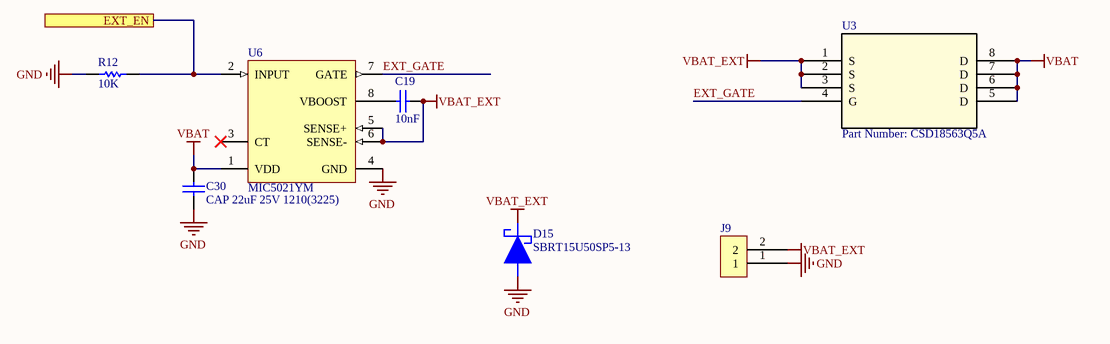
[diagram p6: External.SchDoc]

### Parts
C19  10nF  [CAPC0603(1608)100_L]
C30  CAP 22uF 25V 1210(3225)  [CAPC1210(3225)220_L]
D15  SBRT15U50SP5-13  [SBRT15U50SP5-13]
J9  (no value)  [2-pin Megafit RA]
R12  10K  [RESC0603(1608)_N]
U3  Part Number: CSD18563Q5A  [DQJ8]
U6  MIC5021YM  [MICL-SOICN-8LD-PL-1_V]

### Ports
EXT_EN

### Nets
GND: C30.1 D15.1 J9.1 R12.2 U6.4(GND)
VBAT: C30.2 U3.5(D) U3.6(D) U3.7(D) U3.8(D) U6.1(VDD)
VBAT_EXT: C19.2 D15.2 J9.2 U3.1(S) U3.2(S) U3.3(S) U6.5(SENSE+) U6.6(SENSE-)
EXT_GATE: U3.4(G) U6.7(GATE)
NetC19_1: C19.1 U6.8(VBOOST)
NetP3_11: R12.1 U6.2(INPUT) ; port EXT_EN

Not connected (* = marked no-connect by the designer): U6 3(CT)*

### Library data of the parts
C19 = CMP-1035-02315-1: as C40 on sheet Thrusters; Rated Voltage: 25 V; Technology: SMT; Max Thickness: 1 mm; Value: 10nF
C30 = CMP-1038-02286-1: as C33 on sheet Thrusters; Rated Voltage: 25 V; Technology: SMT; Max Thickness: 2.2 mm; Value: 22uF; Tolerance: -20% to +80%
D15 = SBRT15U50SP5-13: as D2 on sheet Power; Supplier 1: Digi-Key; Supplier Part Number 1: SBRT15U50SP5-13DICT-ND; Manufacturer Part Number: SBRT15U50SP5-13; RoHS: RoHS Compliant; Category: Discrete Semiconductor Products; Stock 1: 12134; Pricing 1: 1=0.93, 10=0.823, 100=0.6306, 500=0.49852, 1000=0.39882 (USD); Packaging: Cut Tape (CT); Part Status: Active; Capacitance @ Vr, F: -; Mounting Type: Surface Mount; Package / Case: PowerDI™ 5; Supplier Device Package: PowerDI®5; Operating Temperature - Junction: -65°C ~ 150°C; ComponentLink1URL: https://media.digikey.com/pdf/Data%20Sheets/Diodes%20PDFs/SBRT15U50SP5.pdf; ComponentLink1Description: https://media.digikey.com/pdf/Data%20Sheets/Diodes%20PDFs/SBRT15U50SP5.pdf
J9 = 2-pin megafit
R12 = CMP-1012-00098-1: as R15 on sheet Thrusters; Technology: SMT; Tolerance: 5 %; Power: 0.1 W
U3 = CSD18563Q5A: as U8 on sheet Thrusters; Manufacturer_Part_Number: CSD18563Q5A; Copyright: Copyright (C) 2018 Accelerated Designs. All rights reserved; RefDes: RefDes; Type: DEV; Value: Value
U6 = CMP-1558-00003-1: as U11 on sheet Thrusters; ComponentLink2Description: Datasheet; Temperature Max: 85 degC; PackageDescription: 8-Pin Small Outline Integrated Package, Body 4.89 x 3.90 mm, Pitch 1.27 mm; ComponentLink1Description: Manufacturer URL; RoHS: TRUE; Temperature Min: -40 degC; ComponentLink2URL: http://www.micrel.com/_PDF/mic5021.pdf; PackageVersion: Rev. A; ComponentLink3Description: Package Specification; PartNumber: MIC5021YM; ComponentLink3URL: http://www.micrel.com/_Packages/SOICN-8LD-PL-1.pdf; Packing: Tube; Mounting Technology: Surface Mount; ComponentLink1URL: http://www.micrel.com/

## Nets that join several sheets
GND: BMS (9 pins), Interface (25 pins), Power (D3.2 NT1.1 R13.2 R14.2), Regulators (36 pins), Thrusters (23 pins), External (5 pins)
RSENSE-: BMS (R32.1), Power (P2.1 R13.1 R14.1), Thrusters (U12.2)
VBAT: BMS (C37.2 R27.2), Power (D2.1 D3.1 P2.2), Thrusters (10 pins), External (6 pins)
VBAT_EXT: Interface (R36.2), External (8 pins)
VBAT_THRUSTERS: Interface (P3.2 R44.2 TP10.1), Thrusters (18 pins)
VCC_3V3: BMS (15 pins), Interface (5 pins), Regulators (F4.2), Thrusters (10 pins)
VCC_5V: Interface (P1.3 P1.4 R42.2 TP6.1), Regulators (F1.2)
VCC_5V_SRV: Interface (P1.5 R41.2 TP5.1), Regulators (F2.2)
VCC_10V: Interface (P1.6 R40.2 TP4.1), Regulators (F3.2)
VCC_BATT_FILT: Interface (5 pins), Power (Q1.2 Q1.4 Q2.2 Q2.4), Regulators (16 pins)
NetP3_5: Interface (P3.5), Power (Q1.1 Q2.1 R3.1 R7.1)
NetP3_6: BMS (R28.2 R30.1), Interface (P3.6 TP3.1)
NetP3_11: Interface (P3.11), External (R12.1 U6.2)
NetP3_13: BMS (R20.1 R24.2), Interface (P3.13 TP2.1)
RSENSE+: BMS (R31.1), Power (NT1.2), Thrusters (U12.1)
THRST_EN: Interface (P3.10), Thrusters (Q3.1 R15.1 U7.6)